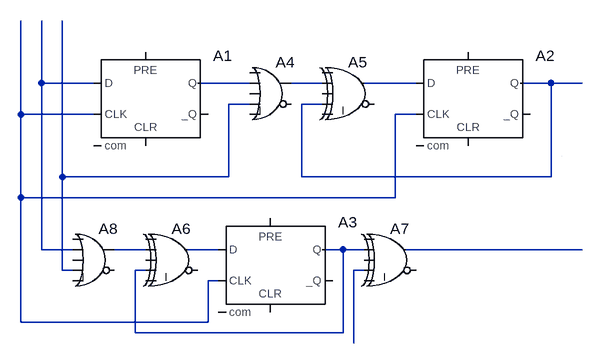
[diagram p0: schematic 8cycleasc.asc]
8cycleasc.asc, the LTspice schematic file:
Version 4
SHEET 1 880 680
WIRE -800 -112 -800 -208
WIRE -720 -112 -800 -112
WIRE -480 -112 -560 -112
WIRE -368 -112 -416 -112
WIRE -224 -112 -304 -112
WIRE -16 -112 -64 -112
WIRE 32 -112 -16 -112
WIRE -480 -80 -512 -80
WIRE -368 -80 -400 -80
WIRE -832 -64 -832 -208
WIRE -720 -64 -832 -64
WIRE -224 -64 -256 -64
WIRE -768 32 -768 -208
WIRE -512 32 -512 -80
WIRE -512 32 -768 32
WIRE -400 32 -400 -80
WIRE -16 32 -16 -112
WIRE -16 32 -400 32
WIRE -832 64 -832 -64
WIRE -256 64 -256 -64
WIRE -256 64 -832 64
WIRE -800 144 -800 -112
WIRE -752 144 -800 144
WIRE -640 144 -688 144
WIRE -528 144 -576 144
WIRE -336 144 -368 144
WIRE -304 144 -336 144
WIRE 32 144 -240 144
WIRE -768 176 -768 32
WIRE -752 176 -768 176
WIRE -640 176 -656 176
WIRE -304 176 -320 176
WIRE -528 192 -544 192
WIRE -832 256 -832 64
WIRE -544 256 -544 192
WIRE -544 256 -832 256
WIRE -656 272 -656 176
WIRE -336 272 -336 144
WIRE -336 272 -656 272
WIRE -320 288 -320 176
WIRE 0 0 0 0
SYMBOL Digital\\dflop -640 -160 R0
SYMATTR InstName A1
SYMBOL Digital\\dflop -144 -160 R0
SYMATTR InstName A2
SYMBOL Digital\\dflop -448 96 R0
SYMATTR InstName A3
SYMBOL Digital\\or -448 -160 R0
SYMATTR InstName A4
SYMBOL Digital\\xor -320 -160 R0
SYMATTR InstName A5
SYMBOL Digital\\xor -592 96 R0
SYMATTR InstName A6
SYMBOL Digital\\xor -256 96 R0
SYMATTR InstName A7
SYMBOL Digital\\or -720 96 R0
SYMATTR InstName A8

The netlist it stands for:
* 8cycleasc.asc
A1 N001 0 N007 0 0 0 N002 0 DFLOP
A2 N004 0 N007 0 0 0 N005 0 DFLOP
A3 N009 0 N007 0 0 0 N010 0 DFLOP
A4 0 N002 0 N006 0 0 N003 0 OR
A5 0 N003 0 N005 0 0 N004 0 XOR
A6 0 N008 0 N010 0 0 N009 0 XOR
A7 0 N010 0 N012 0 0 N011 0 XOR
A8 0 N001 0 N006 0 0 N008 0 OR
.backanno
.end